# EAGLE schematic mainboard_v1 (EAGLE 9.4.2)
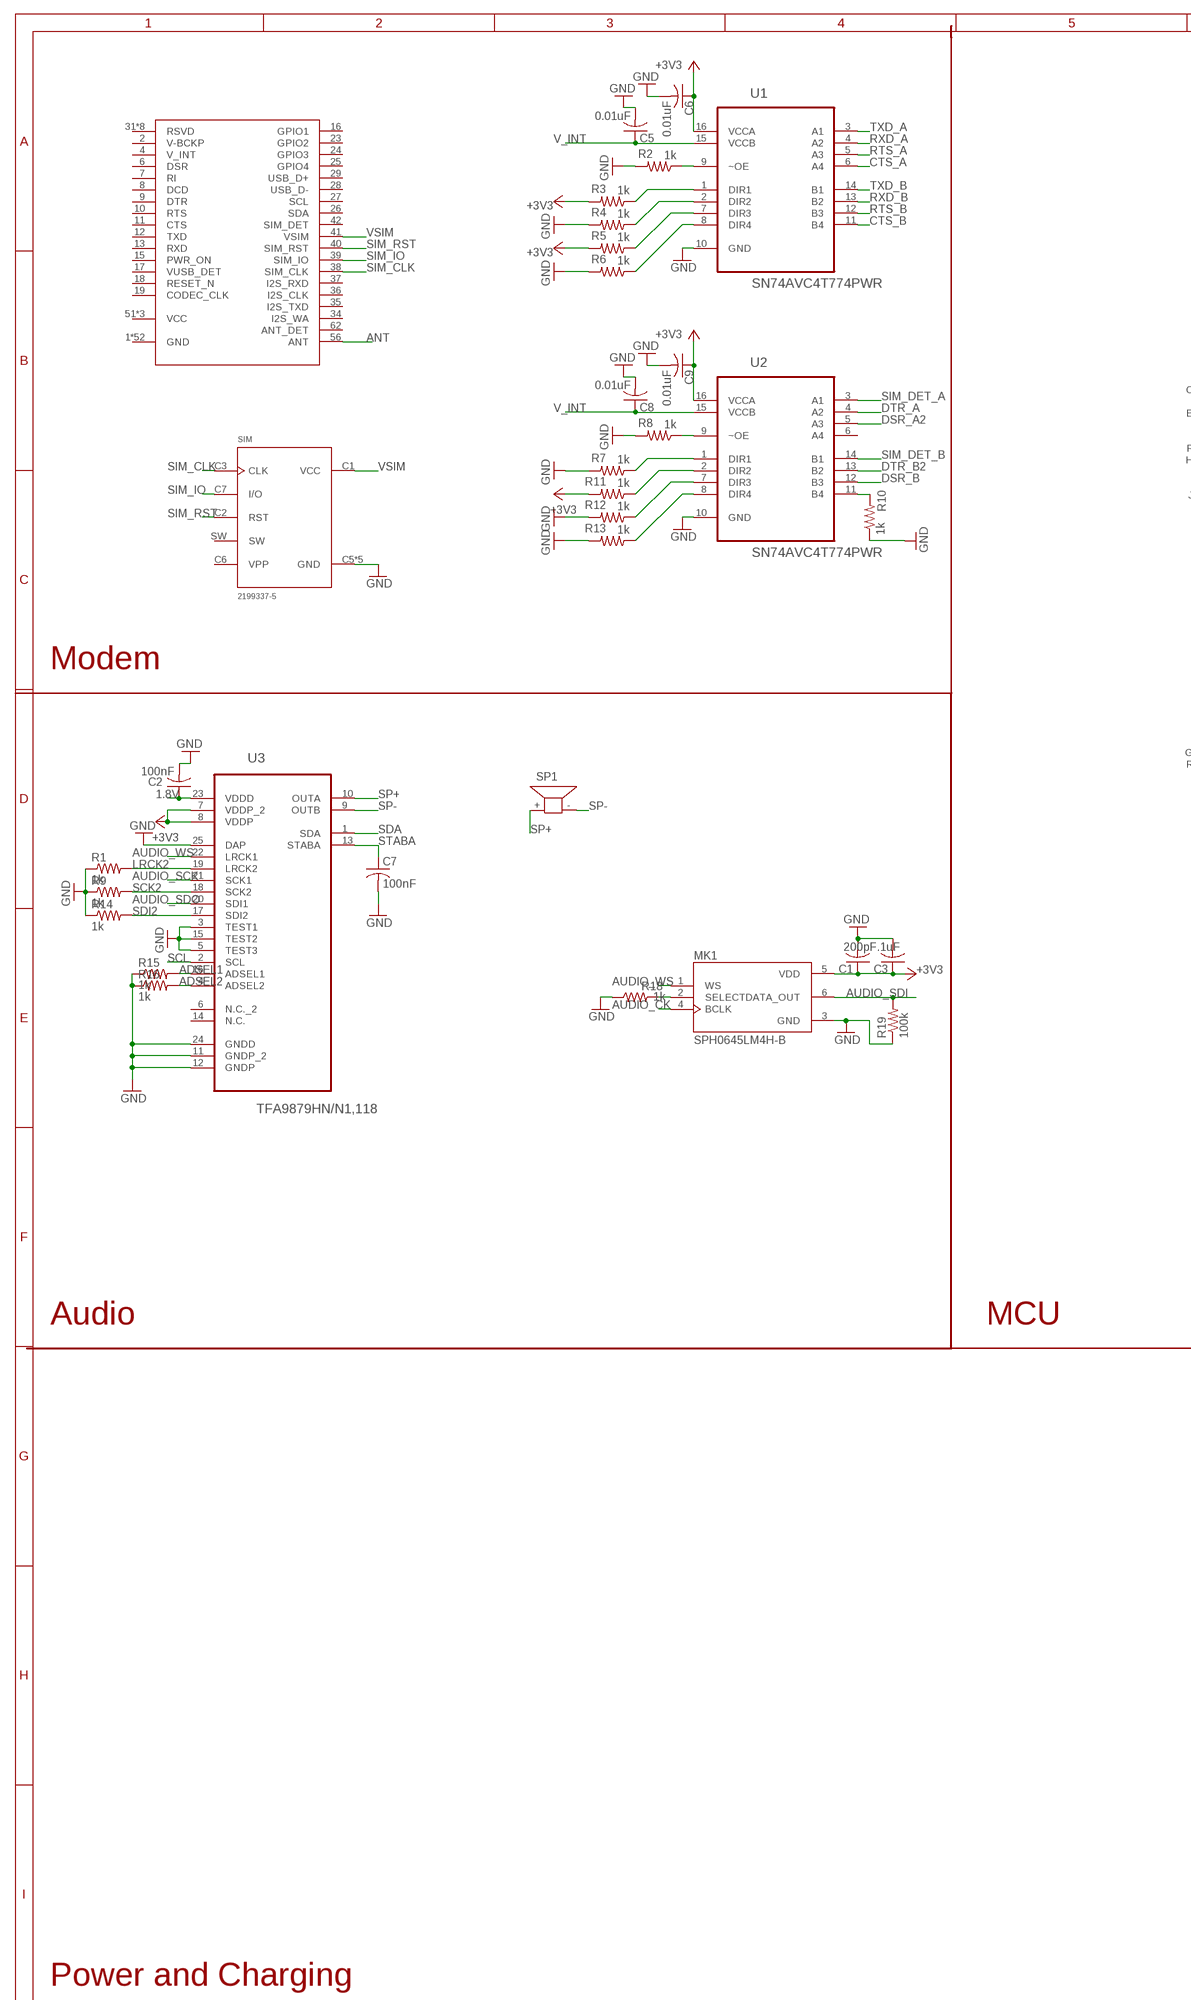
[diagram p0: schematic, sheet 1, part 1 of 2]
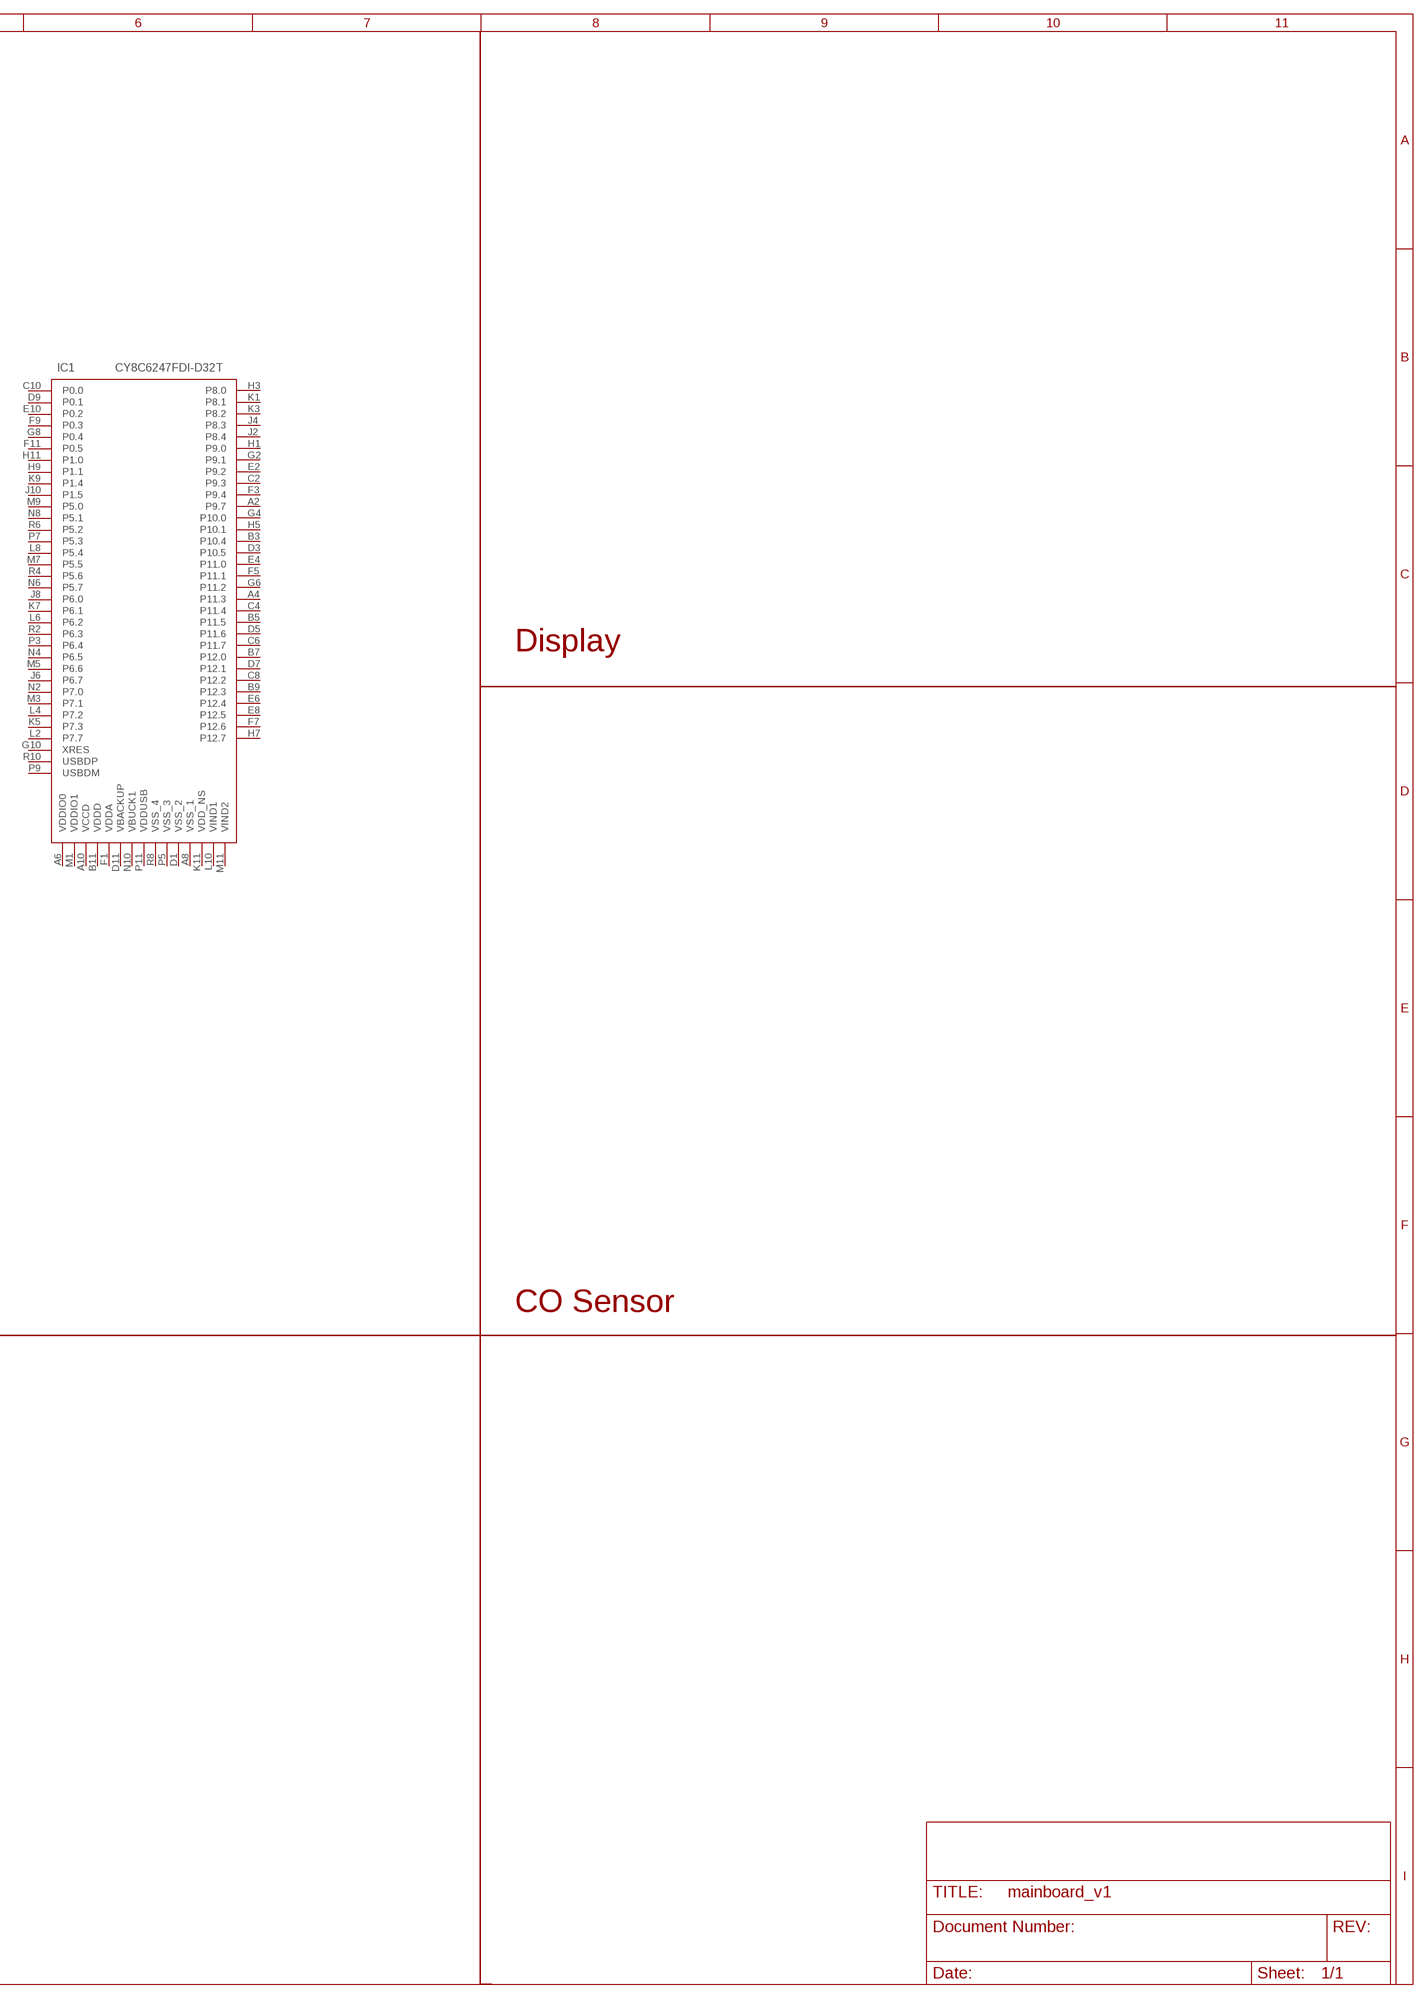
[diagram p1: schematic, sheet 1, part 2 of 2]

## Parts
C1  200pF  C-USC0603  [C0603]
C2  100nF  C-USC0603  [C0603]
C3  .1uF  C-USC0603  [C0603]
C5  0.01uF  C-USC0603  [C0603]
C6  0.01uF  C-USC0603  [C0603]
C7  100nF  C-USC0603  [C0603]
C8  0.01uF  C-USC0603  [C0603]
C9  0.01uF  C-USC0603  [C0603]
IC1  CY8C6247FDI-D32T  [BGA80C30P11X15_368X319X47]
MK1  SPH0645LM4H-B  [MIC_SPH0645LM4H-B]
R1  1k  R-US_R0603  [R0603]
R2  1k  R-US_R0603  [R0603]
R3  1k  R-US_R0603  [R0603]
R4  1k  R-US_R0603  [R0603]
R5  1k  R-US_R0603  [R0603]
R6  1k  R-US_R0603  [R0603]
R7  1k  R-US_R0603  [R0603]
R8  1k  R-US_R0603  [R0603]
R9  1k  R-US_R0603  [R0603]
R10  1k  R-US_R0603  [R0603]
R11  1k  R-US_R0603  [R0603]
R12  1k  R-US_R0603  [R0603]
R13  1k  R-US_R0603  [R0603]
R14  1k  R-US_R0603  [R0603]
R15  1k  R-US_R0603  [R0603]
R16  1k  R-US_R0603  [R0603]
R18  1k  R-US_R0603  [R0603]
R19  100k  R-US_R0603  [R0603]
SIM  2199337-5  [TE_2199337-5]
SP1  KSS1201  [KSS1201]
U1  SN74AVC4T774PWR  [SOP65P640X120-16N]
U2  SN74AVC4T774PWR  [SOP65P640X120-16N]
U3  TFA9879HN/N1,118  [QFN50P260X260X100-25N]
U$1  SARA-U260  [XCVR_SARA-N200-02B]

## Nets
1.8V: C2.1 U3.23(VDDD)
+3V3 [GND/voltage]: C1.1 C3.1 C6.1 C9.1 MK1.5(VDD) R3.2 R5.2 R11.2 U1.16(VCCA) U2.16(VCCA) U3.7(VDDP_2) U3.8(VDDP)
ADSEL1: R15.2 U3.16(ADSEL1)
ADSEL2: R16.2 U3.4(ADSEL2)
ANT: U$1.56(ANT)
AUDIO_CK: MK1.4(BCLK)
AUDIO_SCK: U3.21(SCK1)
AUDIO_SDI: MK1.6(DATA_OUT) R19.2
AUDIO_SDO: U3.20(SDI1)
AUDIO_WS: MK1.1(WS) U3.22(LRCK1)
CTS_A: U1.6(A4)
CTS_B: U1.11(B4)
DSR_A2: U2.5(A3)
DSR_B: U2.12(B3)
DTR_A: U2.4(A2)
DTR_B2: U2.13(B2)
GND [GND/voltage]: C1.2 C2.2 C3.2 C5.2 C6.2 C7.2 C8.2 C9.2 MK1.3(GND) R1.1 R2.2 R4.2 R6.2 R7.2 R8.2 R9.1 R10.1 R12.2 R13.2 R14.1 R15.1 R16.1 R18.1 R19.1 SIM.C5(GND) SIM.G1(GND) SIM.G2(GND) SIM.G3(GND) SIM.G4(GND) U1.10(GND) U2.10(GND) U3.3(TEST1) U3.5(TEST3) U3.11(GNDP_2) U3.12(GNDP) U3.15(TEST2) U3.24(GNDD) U3.25(DAP)
LRCK2: R1.2 U3.19(LRCK2)
N$1: R3.1 U1.1(DIR1)
N$2: R4.1 U1.2(DIR2)
N$3: R5.1 U1.7(DIR3)
N$5: MK1.2(SELECT) R18.2
N$6: R6.1 U1.8(DIR4)
N$7: R7.1 U2.1(DIR1)
N$8: R11.1 U2.2(DIR2)
N$9: R12.1 U2.7(DIR3)
N$10: R8.1 U2.9(~OE)
N$12: R13.1 U2.8(DIR4)
N$13: R10.2 U2.11(B4)
N$18: R2.1 U1.9(~OE)
RTS_A: U1.5(A3)
RTS_B: U1.12(B3)
RXD_A: U1.4(A2)
RXD_B: U1.13(B2)
SCK2: R9.2 U3.18(SCK2)
SCL: U3.2(SCL)
SDA: U3.1(SDA)
SDI2: R14.2 U3.17(SDI2)
SIM_CLK: SIM.C3(CLK) U$1.38(SIM_CLK)
SIM_DET_A: U2.3(A1)
SIM_DET_B: U2.14(B1)
SIM_IO: SIM.C7(I/O) U$1.39(SIM_IO)
SIM_RST: SIM.C2(RST) U$1.40(SIM_RST)
SP+: SP1.+ U3.10(OUTA)
SP-: SP1.- U3.9(OUTB)
STABA: C7.1 U3.13(STABA)
TXD_A: U1.3(A1)
TXD_B: U1.14(B1)
V_INT: C5.1 C8.1 U1.15(VCCB) U2.15(VCCB)
VSIM: SIM.C1(VCC) U$1.41(VSIM)
Unconnected: IC1.A2(P9.7) IC1.A4(P11.3) IC1.A6(VDDIO0) IC1.A8(VSS_1) IC1.A10(VCCD) IC1.B3(P10.4) IC1.B5(P11.5) IC1.B7(P12.0) IC1.B9(P12.3) IC1.B11(VDDD) IC1.C2(P9.3) IC1.C4(P11.4) IC1.C6(P11.7) IC1.C8(P12.2) IC1.C10(P0.0) IC1.D1(VSS_2) IC1.D3(P10.5) IC1.D5(P11.6) IC1.D7(P12.1) IC1.D9(P0.1) IC1.D11(VBACKUP) IC1.E2(P9.2) IC1.E4(P11.0) IC1.E6(P12.4) IC1.E8(P12.5) IC1.E10(P0.2) IC1.F1(VDDA) IC1.F3(P9.4) IC1.F5(P11.1) IC1.F7(P12.6) IC1.F9(P0.3) IC1.F11(P0.5) IC1.G2(P9.1) IC1.G4(P10.0) IC1.G6(P11.2) IC1.G8(P0.4) IC1.G10(XRES) IC1.H1(P9.0) IC1.H3(P8.0) IC1.H5(P10.1) IC1.H7(P12.7) IC1.H9(P1.1) IC1.H11(P1.0) IC1.J2(P8.4) IC1.J4(P8.3) IC1.J6(P6.7) IC1.J8(P6.0) IC1.J10(P1.5) IC1.K1(P8.1) IC1.K3(P8.2) IC1.K5(P7.3) IC1.K7(P6.1) IC1.K9(P1.4) IC1.K11(VDD_NS) IC1.L2(P7.7) IC1.L4(P7.2) IC1.L6(P6.2) IC1.L8(P5.4) IC1.L10(VIND1) IC1.M1(VDDIO1) IC1.M3(P7.1) IC1.M5(P6.6) IC1.M7(P5.5) IC1.M9(P5.0) IC1.M11(VIND2) IC1.N2(P7.0) IC1.N4(P6.5) IC1.N6(P5.7) IC1.N8(P5.1) IC1.N10(VBUCK1) IC1.P3(P6.4) IC1.P5(VSS_3) IC1.P7(P5.3) IC1.P9(USBDM) IC1.P11(VDDUSB) IC1.R2(P6.3) IC1.R4(P5.6) IC1.R6(P5.2) IC1.R8(VSS_4) IC1.R10(USBDP) SIM.C6(VPP) SIM.SW U2.6(A4) U3.6(N.C._2) U3.14(N.C.) U$1.1(GND) U$1.2(V-BCKP) U$1.3(GND) U$1.4(V_INT) U$1.5(GND) U$1.6(DSR) U$1.7(RI) U$1.8(DCD) U$1.9(DTR) U$1.10(RTS) U$1.11(CTS) U$1.12(TXD) U$1.13(RXD) U$1.14(GND) U$1.15(PWR_ON) U$1.16(GPIO1) U$1.17(VUSB_DET) U$1.18(RESET_N) U$1.19(CODEC_CLK) U$1.20(GND) U$1.21(GND) U$1.22(GND) U$1.23(GPIO2) U$1.24(GPIO3) U$1.25(GPIO4) U$1.26(SDA) U$1.27(SCL) U$1.28(USB_D-) U$1.29(USB_D+) U$1.30(GND) U$1.31(RSVD) U$1.32(GND) U$1.33(RSVD) U$1.34(I2S_WA) U$1.35(I2S_TXD) U$1.36(I2S_CLK) U$1.37(I2S_RXD) U$1.42(SIM_DET) U$1.43(GND) U$1.44(RSVD) U$1.45(RSVD) U$1.46(RSVD) U$1.47(RSVD) U$1.48(RSVD) U$1.49(RSVD) U$1.50(GND) U$1.51(VCC) U$1.52(VCC) U$1.53(VCC) U$1.54(GND) U$1.55(GND) U$1.57(GND) U$1.58(GND) U$1.59(GND) U$1.60(GND) U$1.61(GND) U$1.62(ANT_DET) U$1.63(GND) U$1.64(GND) U$1.65(GND) U$1.66(GND) U$1.67(GND) U$1.68(GND) U$1.69(GND) U$1.70(GND) U$1.71(GND) U$1.72(GND) U$1.73(GND) U$1.74(GND) U$1.75(GND) U$1.76(GND) U$1.77(GND) U$1.78(GND) U$1.79(GND) U$1.80(GND) U$1.81(GND) U$1.82(GND) U$1.83(GND) U$1.84(GND) U$1.85(GND) U$1.86(GND) U$1.87(GND) U$1.88(GND) U$1.89(GND) U$1.90(GND) U$1.91(GND) U$1.92(GND) U$1.93(GND) U$1.94(GND) U$1.95(GND) U$1.96(GND)

## Notes on the sheet
- Display
- Modem
- Audio | MCU | CO Sensor
- Power and Charging

## Library data of the parts
C1-C3 C5-C9 = adafruit:C-US: CAPACITOR, American symbol
IC1 = SamacSys_Parts:CY8C6247FDI-D32T: ARM Microcontrollers - MCU Source: Datasheet <https://componentsearchengine.com/Datasheets/1/CY8C6247FDI-D32T.pdf>; DESCRIPTION: ARM Microcontrollers - MCU; HEIGHT: 0.467mm; MANUFACTURER_NAME: Cypress Semiconductor; MANUFACTURER_PART_NUMBER: CY8C6247FDI-D32T; MOUSER_PART_NUMBER: 727-CY8C6247FDI-D32T; MOUSER_PRICE-STOCK: https://www.mouser.com/Search/Refine.aspx?Keyword=727-CY8C6247FDI-D32T
MK1 = SPH0645LM4H-B:SPH0645LM4H-B: Mic Mems Digital I2s Omni -26db; DESCRIPTION: Mic Mems Digital I2s Omni -26db; DIGI-KEY_PART_NUMBER: 423-1405-1-ND; DIGI-KEY_PURCHASE_URL: https://www.digikey.com/product-detail/en/knowles/SPH0645LM4H-B/423-1405-1-ND/5332432?utm_source=snapeda&utm_medium=aggregator&utm_campaign=symbol; MF: Knowles; MP: SPH0645LM4H-B; PACKAGE: SIP-7 Bourns
R1-R16 R18 R19 = adafruit:R-US_: RESISTOR, American symbol
SIM = 2199337-5:2199337-5: CONN MICRO SIM CARD PUSH-PULL; CENTERLINE_PITCH: 2.54 mm[.1 in]; COMMENT: 2199337-5; DESCRIPTION: ASS'Y FOR MICRO SIM H1.18 8POS _EMBOSS_; DIGI-KEY_PART_NUMBER: A125065CT-ND; DIGI-KEY_PURCHASE_URL: https://www.digikey.com/product-detail/en/te-connectivity-amp-connectors/2199337-5/A125065CT-ND/6810766?utm_source=snapeda&utm_medium=aggregator&utm_campaign=symbol; EU_ROHS_COMPLIANCE: Compliant; MF: TE Connectivity; MP: 2199337-5; NUMBER_OF_POSITIONS: 8; PACKAGE: None; PRODUCT_TYPE: Connector; TE_PURCHASE_URL: https://www.te.com/usa-en/product-2199337-5.html?te_bu=Cor&te_type=disp&te_campaign=seda_glo_cor-seda-global-disp-prtnr-fy19-seda-model-bom-cta_sma-317_1&elqCampaignId=32493
SP1 = buzzer:KSS1201: SPEAKER Source: Schukat; OC_FARNELL: unknown; OC_NEWARK: unknown
U1 U2 = SN74AVC4T774PWR:SN74AVC4T774PWR: 4-BIT DUAL-SUPPLY BUS TRANSCEIVER; DESCRIPTION: 4-Bit Dual-Supply Bus Transceiver With Configurable Voltage-Level Shifting and 3-State Outputs 16-TSSOP -40 to 85; DIGI-KEY_PART_NUMBER: 296-24739-1-ND; DIGI-KEY_PURCHASE_URL: https://www.digikey.com/product-detail/en/texas-instruments/SN74AVC4T774PWR/296-24739-1-ND/2092561?utm_source=snapeda&utm_medium=aggregator&utm_campaign=symbol; MF: Texas Instruments; MP: SN74AVC4T774PWR; PACKAGE: TSSOP-16 Texas Instruments
U3 = TFA9879HN_N1_118:TFA9879HN/N1,118: Mono BTL class-D audio amplifier for portable applications with digital input; AVAILABILITY: Unavailable; DESCRIPTION: Audio Amp Speaker 1-CH Mono 2.75W Class-D 24-Pin HVQFN EP T/R; MF: NXP USA; MP: TFA9879HN/N1,118; PACKAGE: HVQFN-24 NXP Semiconductors; PRICE: None
U$1 = XCVR_SARA-N200-02B:SARA-U260

## Net classes
0 default: width 0.203 mm, clearance 0.203 mm
1 GND/voltage: width 0.457 mm, drill 0.152 mm, clearance 0.203 mm